# EAGLE design final (EAGLE 7.5.0)
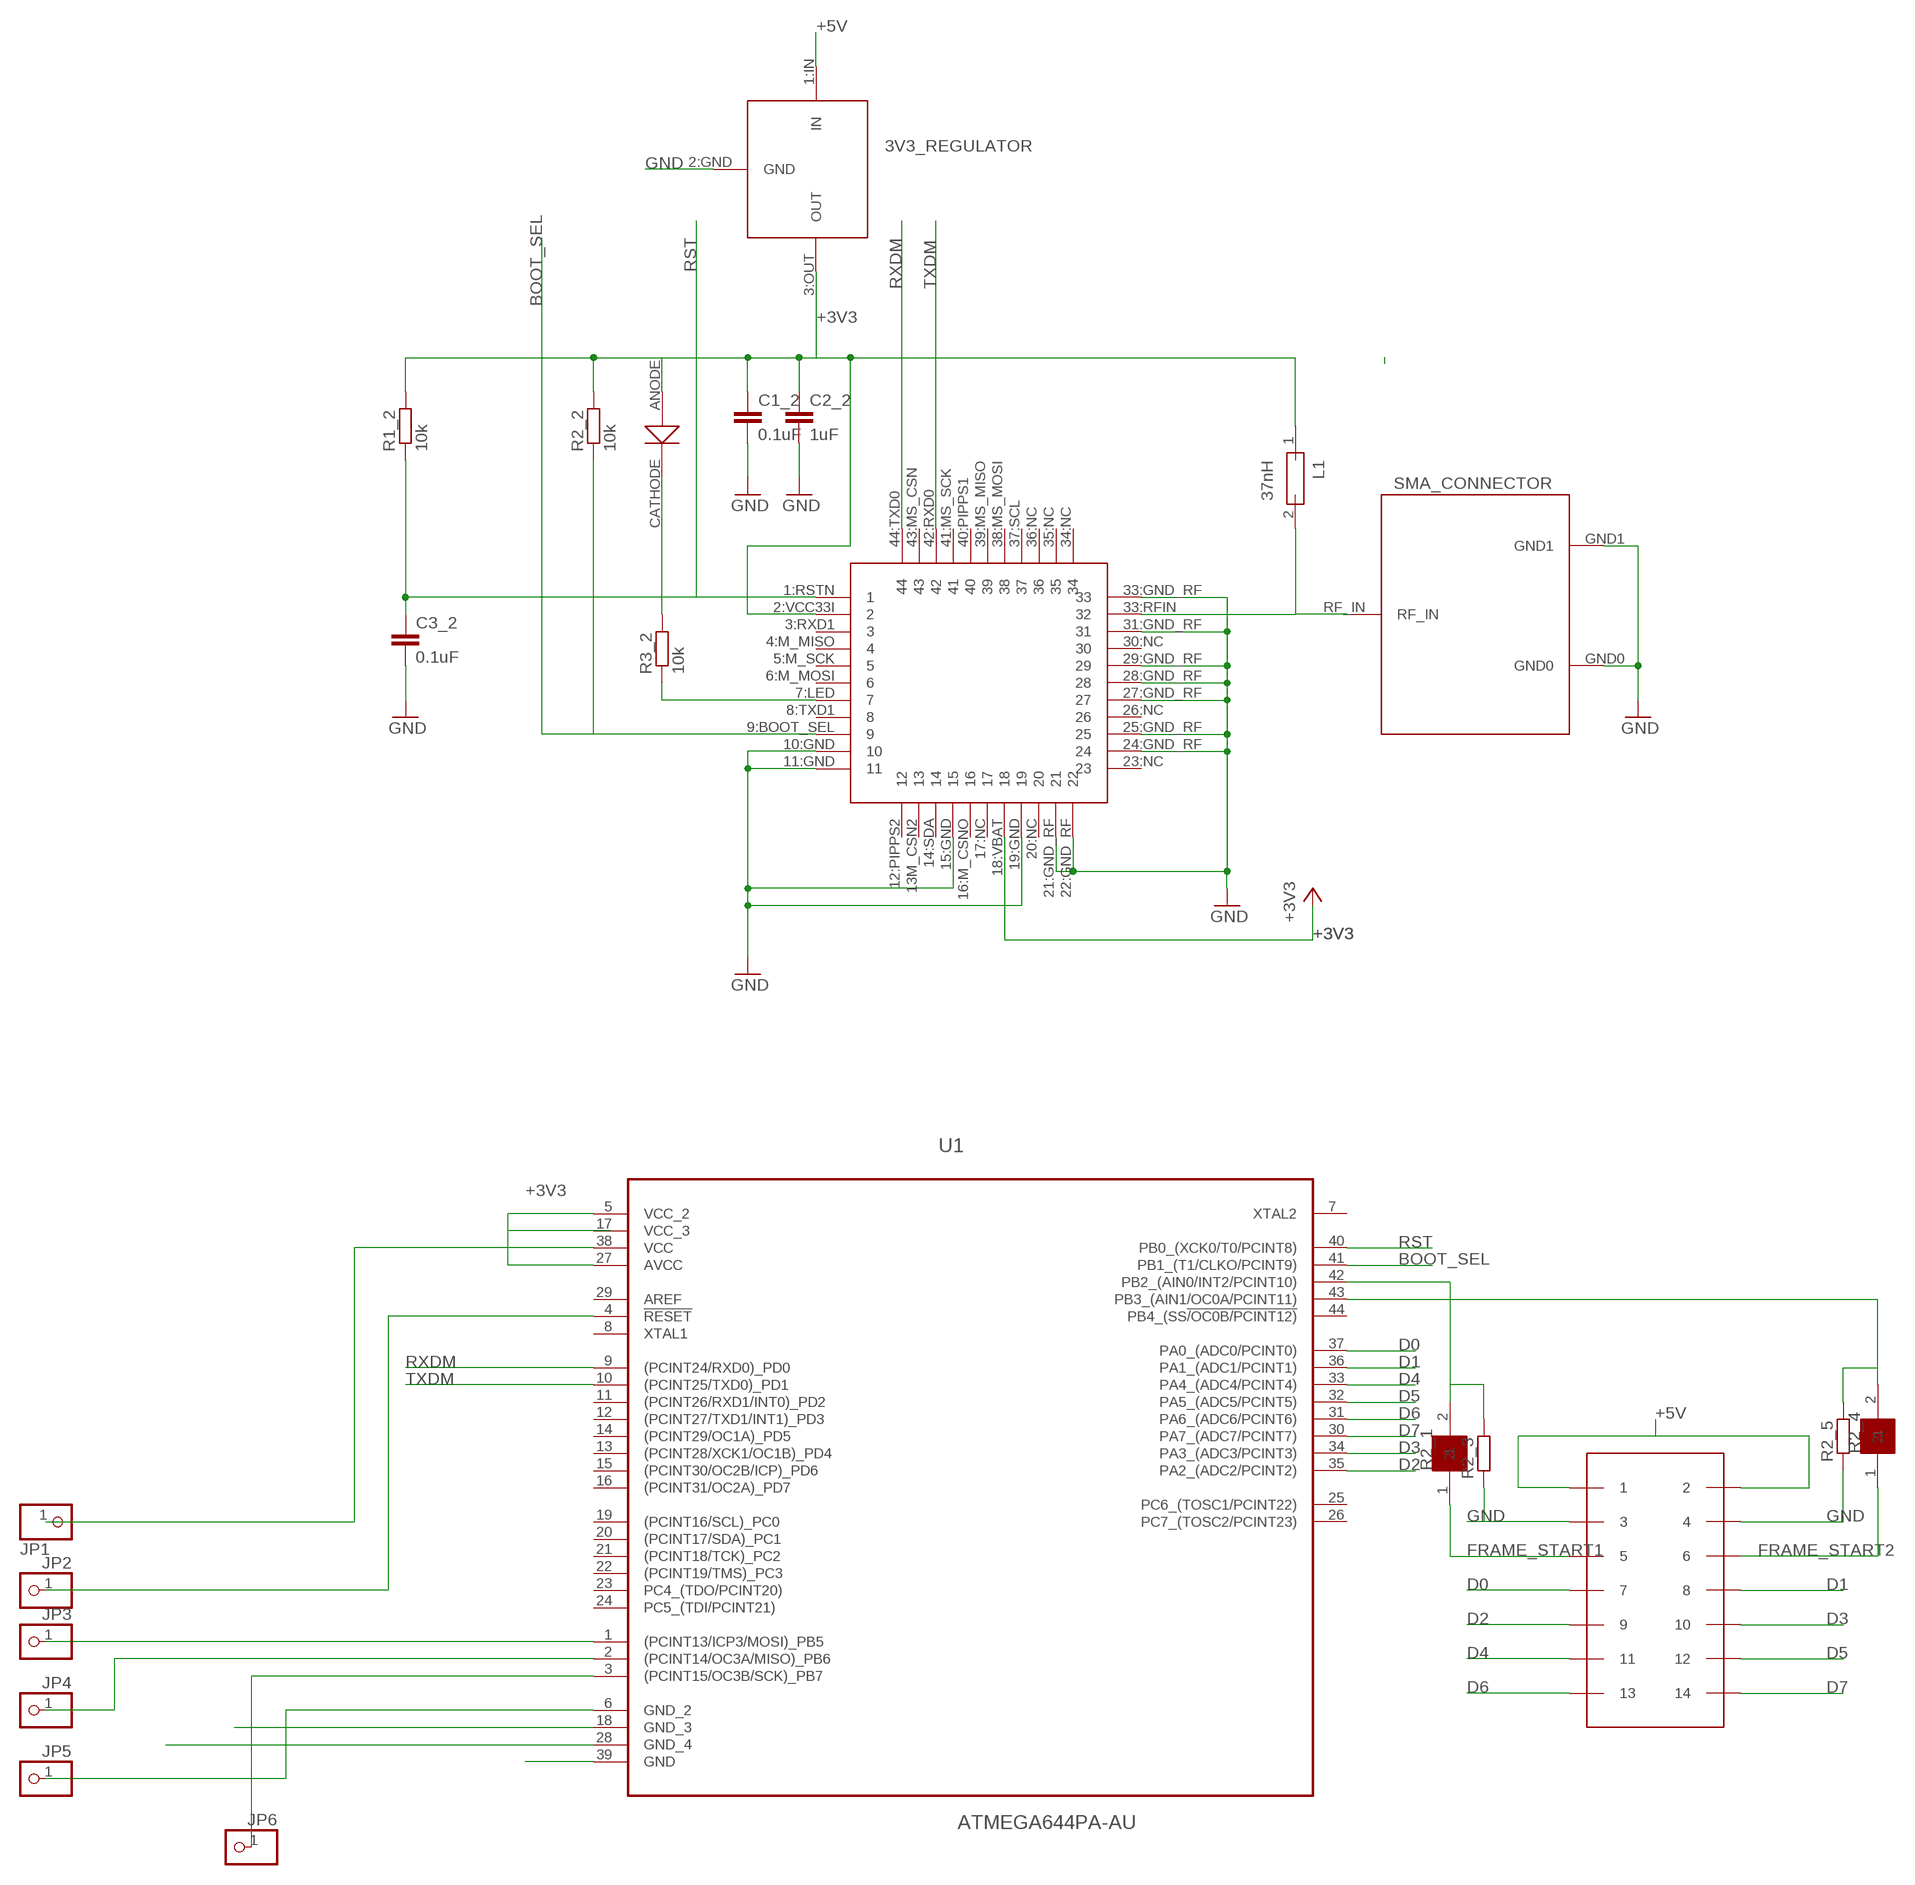
[diagram p0: schematic, sheet 1]

## Parts
3V3_REGULATOR  LM3940IT-3.3/NOPB  [3PIN]
C1_2  0.1uF  C-EUC0402  [C0402]
C2_2  1uF  C-EUC0402  [C0402]
C3_2  0.1uF  C-EUC0402  [C0402]
GPS_1  VENUS838FLPX  [LGA-44]
HARWIN_CONNECTOR  HARWIN_CONNECTOR  [14DIP]
JP1  PINHD-1X1  [1X01]
JP2  PINHD-1X1  [1X01]
JP3  PINHD-1X1  [1X01]
JP4  PINHD-1X1  [1X01]
JP5  PINHD-1X1  [1X01]
JP6  PINHD-1X1  [1X01]
L1  37nH  0805_INDUCTOR  [0805]
R1_2  10k  R-EU_R0402  [R0402]
R2_1  0805RESISTOR  [0805]
R2_2  10k  R-EU_R0402  [R0402]
R2_3  R-EU_R0402  [R0402]
R2_4  0805RESISTOR  [0805]
R2_5  R-EU_R0402  [R0402]
R3_2  10k  R-EU_R0402  [R0402]
SMA_CONNECTOR  SMA_SIDE  [SMA_SIDE]
U1  ATMEGA644PA-AU  [QFP80P1200X1200X120-44N]
U$1  HSMH-C190-DIODE  [HSMH-C190-DIODE]

## Nets
+3V3: 3V3_REGULATOR.3:OUT(OUT) C1_2.1 C2_2.1 GPS_1.2:VCC33I GPS_1.18:VBAT JP1.1 L1.1 R1_2.2 R2_2.2 U1.5(VCC_2) U1.17(VCC_3) U1.27(AVCC) U1.38(VCC) U$1.ANODE(AN)
+5V: 3V3_REGULATOR.1:IN(IN) HARWIN_CONNECTOR.1 HARWIN_CONNECTOR.2
BOOT_SEL: GPS_1.9:BOOT_SEL R2_2.1 U1.41(PB1_(T1/CLKO/PCINT9))
D0: HARWIN_CONNECTOR.7 U1.37(PA0_(ADC0/PCINT0))
D1: HARWIN_CONNECTOR.8 U1.36(PA1_(ADC1/PCINT1))
D2: HARWIN_CONNECTOR.9 U1.35(PA2_(ADC2/PCINT2))
D3: HARWIN_CONNECTOR.10 U1.34(PA3_(ADC3/PCINT3))
D4: HARWIN_CONNECTOR.11 U1.33(PA4_(ADC4/PCINT4))
D5: HARWIN_CONNECTOR.12 U1.32(PA5_(ADC5/PCINT5))
D6: HARWIN_CONNECTOR.13 U1.31(PA6_(ADC6/PCINT6))
D7: HARWIN_CONNECTOR.14 U1.30(PA7_(ADC7/PCINT7))
FRAME_START1: HARWIN_CONNECTOR.5 R2_1.1
FRAME_START2: HARWIN_CONNECTOR.6 R2_4.1
GND: 3V3_REGULATOR.2:GND(GND) C1_2.2 C2_2.2 C3_2.2 GPS_1.10:GND GPS_1.11:GND GPS_1.15:GND GPS_1.19:GND GPS_1.21:GND_RF GPS_1.22:GND_RF GPS_1.24:GND_RF GPS_1.25:GND_RF GPS_1.27:GND_RF GPS_1.28:GND_RF GPS_1.29:GND_RF GPS_1.31:GND_RF GPS_1.33:GND_RF HARWIN_CONNECTOR.3 HARWIN_CONNECTOR.4 JP5.1 R2_3.1 R2_5.1 SMA_CONNECTOR.GND0 SMA_CONNECTOR.GND1 U1.6(GND_2) U1.18(GND_3) U1.28(GND_4) U1.39(GND)
MISO: JP4.1 U1.2((PCINT14/OC3A/MISO)_PB6)
MOSI: JP3.1 U1.1((PCINT13/ICP3/MOSI)_PB5)
N$2: R3_2.2 U$1.CATHODE(CATH)
N$3: GPS_1.7:LED R3_2.1
N$5: R2_1.2 R2_3.2 U1.42(PB2_(AIN0/INT2/PCINT10))
N$6: R2_4.2 R2_5.2 U1.43(PB3_(AIN1/OC0A/PCINT11))
RESET: JP2.1 U1.4(!RESET)
RFIN_2: GPS_1.33:RFIN L1.2 SMA_CONNECTOR.RF_IN
RST: C3_2.1 GPS_1.1:RSTN R1_2.1 U1.40(PB0_(XCK0/T0/PCINT8))
RXDM: GPS_1.44:TXD0 U1.9((PCINT24/RXD0)_PD0)
SCK: JP6.1 U1.3((PCINT15/OC3B/SCK)_PB7)
TXDM: GPS_1.42:RXD0 U1.10((PCINT25/TXD0)_PD1)
Unconnected: GPS_1.3:RXD1 GPS_1.4:M_MISO GPS_1.5:M_SCK GPS_1.6:M_MOSI GPS_1.8:TXD1 GPS_1.12:PIPPS2 GPS_1.13M_CSN2 GPS_1.14:SDA GPS_1.16:M_CSNO GPS_1.17:NC GPS_1.20:NC GPS_1.23:NC GPS_1.26:NC GPS_1.30:NC GPS_1.34:NC GPS_1.35:NC GPS_1.36:NC GPS_1.37:SCL GPS_1.38:MS_MOSI GPS_1.39:MS_MISO GPS_1.40:PIPPS1 GPS_1.41:MS_SCK GPS_1.43:MS_CSN U1.7(XTAL2) U1.8(XTAL1) U1.11((PCINT26/RXD1/INT0)_PD2) U1.12((PCINT27/TXD1/INT1)_PD3) U1.13((PCINT28/XCK1/OC1B)_PD4) U1.14((PCINT29/OC1A)_PD5) U1.15((PCINT30/OC2B/ICP)_PD6) U1.16((PCINT31/OC2A)_PD7) U1.19((PCINT16/SCL)_PC0) U1.20((PCINT17/SDA)_PC1) U1.21((PCINT18/TCK)_PC2) U1.22((PCINT19/TMS)_PC3) U1.23(PC4_(TDO/PCINT20)) U1.24(PC5_(TDI/PCINT21)) U1.25(PC6_(TOSC1/PCINT22)) U1.26(PC7_(TOSC2/PCINT23)) U1.29(AREF) U1.44(PB4_(SS!/OC0B/PCINT12))

## Library data of the parts
3V3_REGULATOR = voltage_regulator:LM3940IT-3.3/NOPB
C1_2 C2_2 C3_2 = resistor:C-EU: CAPACITOR, European symbol
GPS_1 = Venus838flpX (1):VENUS838FLPX
HARWIN_CONNECTOR = connector:HARWIN_CONNECTOR
JP1-JP6 = pinhead:PINHD-1X1: PIN HEADER
L1 = inductor:0805_INDUCTOR
R1_2 R2_2 R2_3 R2_5 R3_2 = resistor:R-EU_: RESISTOR, European symbol
R2_1 R2_4 = 0805:0805RESISTOR
SMA_CONNECTOR = SMA:SMA_SIDE
U1 = ATMEGA644paau:ATMEGA644PA-AU: 8-bit Microcontroller with 16/32/64/128K Bytes,TQFP-44; MPN: ATMEGA644PA-AU; OC_FARNELL: 1972106; OC_NEWARK: 68T3119; PACKAGE: TQFP-44; SUPPLIER: ATMEL
U$1 = 0201_diode:HSMH-C190-DIODE

## Board
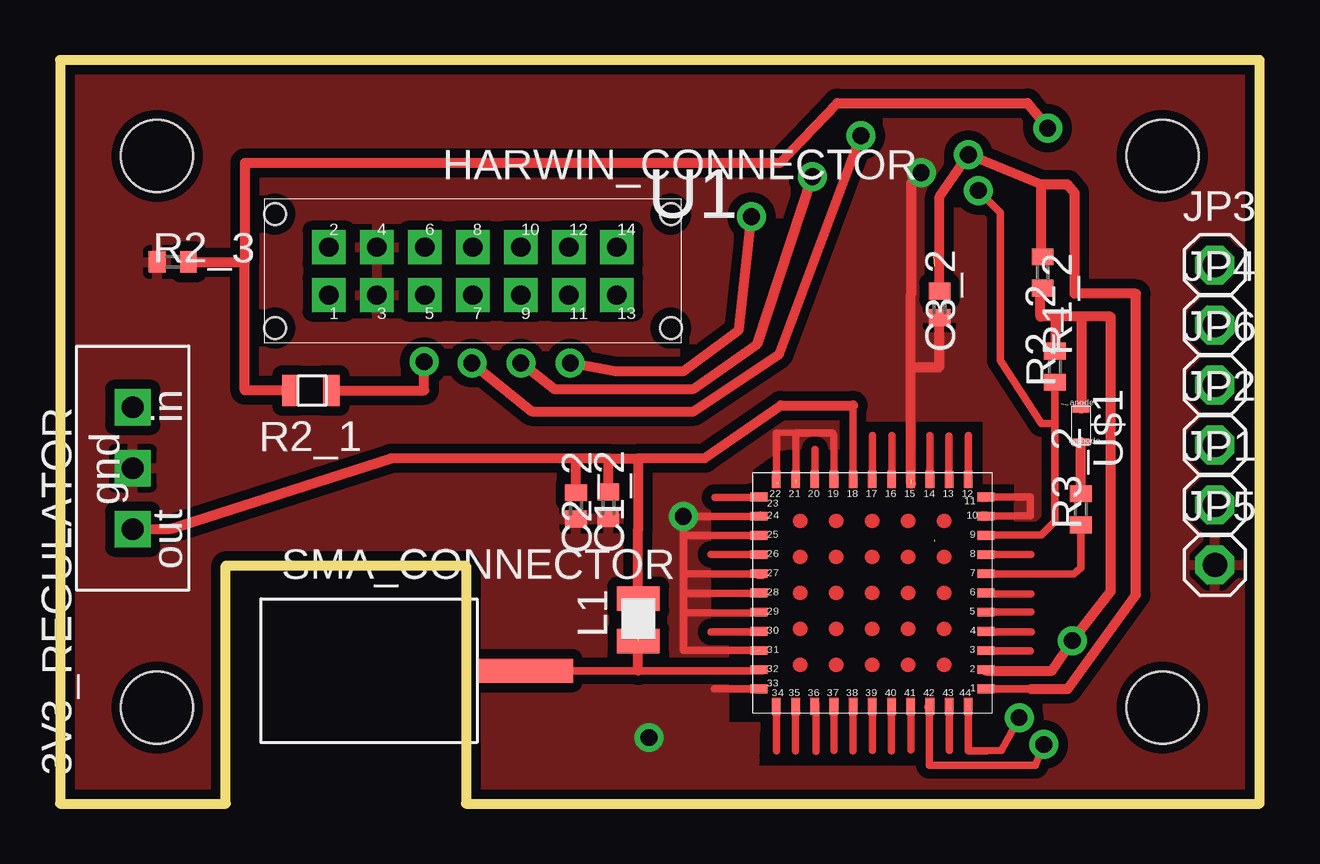
[diagram p1: board, top side]
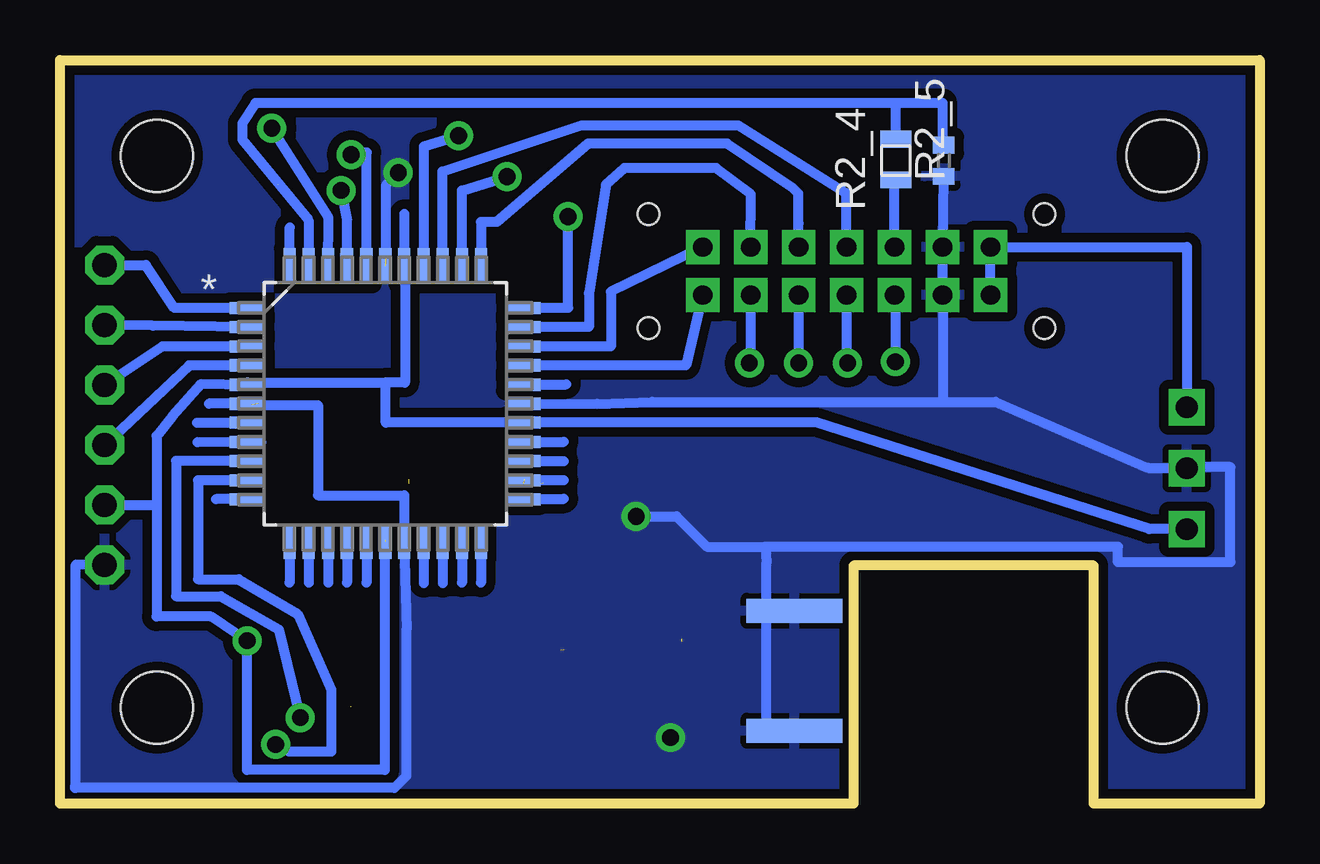
[diagram p2: board, bottom side, seen from below]

Size 50 x 31 mm. Coordinates in mm from the lower left corner, seen from the top.
Outline: 0,0 6.91,0 6.91,9.92 16.92,9.92 16.92,0 50,0 50,31 0,31 0,0
Copper layers (1*16): Top 0.035mm / dielectric 1.5mm / Bottom 0.035mm
Design rules "SparkFun *": minimum track width 8mil, minimum drill 20mil, track to track 0.3mm, track to pad 8mil, pad to pad 8mil, via to via 8mil, smd to smd 8mil, copper to edge 8mil, drill to drill 8mil, minimum pad ring 12mil, minimum via ring 10mil, stop-mask expansion 4mil, vias tented up to drill 20mil, thermal gap 10mil
Holes 3 mm at 4.05,4 45.95,4 45.95,27 4.05,27

### Footprints (pad centres in the part's own frame; a part is rotated, then mirrored left to right if it is on the bottom)
3PIN = drill 0.9 square: 1:IN -2.54,0; 2:GND 0,0; 3:OUT 2.54,0
C0402 = smd 0.7 x 0.9: 1 -0.65,0; 2 0.45,0
LGA-44 = smd 0.7 x 0.36: 1:RSTN -4.73,4; 2:VCC33I -4.73,3.2; 3:RXD1 -4.73,2.4; 4:M_MISO -4.73,1.6; 5:M_SCK -4.73,0.8; 6:M_MOSI -4.73,0; 7:LED -4.73,-0.8; 8:TXD1 -4.73,-1.6; 9:BOOT_SEL -4.73,-2.4; 10:GND -4.73,-3.2; 11:GND -4.73,-4; 23:NC 4.73,-4; 24:GND_RF 4.73,-3.2; 25:GND_RF 4.73,-2.4; 26:NC 4.73,-1.6; 27:GND_RF 4.73,-0.8; 28:GND_RF 4.73,0; 29:GND_RF 4.73,0.8; 30:NC 4.73,1.6; 31:GND_RF 4.73,2.4; 33:GND_RF 4.73,4; 33:RFIN 4.73,3.2 | smd 0.36 x 0.7: 12:PIPPS2 -4,-4.73; 13M_CSN2 -3.2,-4.73; 14:SDA -2.4,-4.73; 15:GND -1.6,-4.73; 16:M_CSNO -0.8,-4.73; 17:NC 0,-4.73; 18:VBAT 0.8,-4.73; 19:GND 1.6,-4.73; 20:NC 2.4,-4.73; 21:GND_RF 3.2,-4.73; 22:GND_RF 4,-4.73; 34:NC 4,4.73; 35:NC 3.2,4.73; 36:NC 2.4,4.73; 37:SCL 1.6,4.73; 38:MS_MOSI 0.8,4.73; 39:MS_MISO 0,4.73; 40:PIPPS1 -0.8,4.73; 41:MS_SCK -1.6,4.73; 42:RXD0 -2.4,4.73; 43:MS_CSN -3.2,4.73; 44:TXD0 -4,4.73
14DIP = drill 0.8 square: 1 -6,-1; 2 -6,1; 3 -4,-1; 4 -4,1; 5 -2,-1; 6 -2,1; 7 0,-1; 8 0,1; 9 2,-1; 10 2,1; 11 4,-1; 12 4,1; 13 6,1; 14 6,-1 | hole 0.9: -8.25,2.375; -8.25,-2.375; 8.25,2.375; 8.25,-2.375
1X01 = drill 1.016 octagon: 1 0,0
0805 = smd 1.02 x 1.78: 1 -0.89,0; 2 0.89,0
R0402 = smd 0.7 x 0.9: 1 -0.65,0; 2 0.65,0
0805' = smd 1.3 x 0.7: 1 0,0; 2 0,1.7
SMA_SIDE = smd 4 x 1 bottom: GND0 0,2.5; GND1 0,-2.5 | smd 4 x 1: RF_IN 0,0
QFP80P1200X1200X120-44N = smd 1.473 x 0.508: 1 -5.74,3.988; 2 -5.74,3.2; 3 -5.74,2.388; 4 -5.74,1.6; 5 -5.74,0.787; 6 -5.74,0; 7 -5.74,-0.787; 8 -5.74,-1.6; 9 -5.74,-2.388; 10 -5.74,-3.2; 11 -5.74,-3.988; 23 5.74,-3.988; 24 5.74,-3.2; 25 5.74,-2.388; 26 5.74,-1.6; 27 5.74,-0.787; 28 5.74,0; 29 5.74,0.787; 30 5.74,1.6; 31 5.74,2.388; 32 5.74,3.2; 33 5.74,3.988 | smd 0.508 x 1.473: 12 -3.988,-5.74; 13 -3.2,-5.74; 14 -2.388,-5.74; 15 -1.6,-5.74; 16 -0.787,-5.74; 17 0,-5.74; 18 0.787,-5.74; 19 1.6,-5.74; 20 2.388,-5.74; 21 3.2,-5.74; 22 3.988,-5.74; 34 3.988,5.74; 35 3.2,5.74; 36 2.388,5.74; 37 1.6,5.74; 38 0.787,5.74; 39 0,5.74; 40 -0.787,5.74; 41 -1.6,5.74; 42 -2.388,5.74; 43 -3.2,5.74; 44 -3.988,5.74
HSMH-C190-DIODE = smd 0.3 x 0.7: ANODE -0.7,0; CATHODE 0.7,0

### Placement (x,y rotation side)
3V3_REGULATOR  3.03,13.98 270 top
C1_2  22.86,12.34 270 top
C2_2  21.51,12.31 270 top
C3_2  36.66,20.71 270 top
GPS_1  33.86,8.78 180 top
HARWIN_CONNECTOR  17.21,22.2 0 top
JP1  48.14,12.45 0 top
JP2  48.14,14.95 0 top
JP3  48.14,22.45 0 top
JP4  48.14,19.95 0 top
JP5  48.14,9.95 0 top
JP6  48.14,17.45 0 top
L1  24.1,7.66 270 top
R1_2  40.96,22.14 270 top
R2_1  0805RESISTOR  [0805']  11.31,17.22 90 top
R2_2  41.47,18.21 90 top
R2_3  4.7,22.58 0 top
R2_4  0805RESISTOR  [0805']  15.16,26 0 bottom
R2_5  13.16,26.8 90 bottom
R3_2  42.55,12.27 90 top
SMA_CONNECTOR  19.38,5.54 0 top
U1  36.44,16.67 0 bottom
U$1  42.56,15.76 270 top

### Tracks (layer width: path | path; a pad name or v marks a point on that pad's centre or on a via)
+3V3  (via drill 0.7)  (1 unrouted)
  Top 0.305: 33.06,16.6 GPS_1.18:VBAT | GPS_1.2:VCC33I 38.59,5.54
  Top 0.406: 3V3_REGULATOR.3:OUT 4.6,11.45 13.79,14.39 21.45,14.39 | 22.87,14.39 21.45,14.39 | 24.1,14.4 24.1,11.43 L1.1 | 24.1,14.4 26.88,14.4 30.05,16.6 33.06,16.6 | R1_2.2 arc90 40.87,21.4 40.87,20.3 41.5,20.3 | 42.6,20.3 43.8,20.3 43.8,8.84 v42.2,6.79 41.35,5.54 38.59,5.54 | 42.6,20.3 41.5,20.3 | U$1.ANODE 42.6,16.5 42.6,20.3 | R2_2.2 41.5,18.89 41.5,20.3 | 22.87,14.39 24.09,14.39 24.1,14.4 | 21.45,14.39 21.51,14.32 C2_2.1 | C1_2.1 22.86,14.38 22.87,14.39
  Bottom 0.406: U1.17 36.42,10.93 | 36.42,17.55 36.42,15.88 U1.27 28.1,15.89 27.41,15.89 18.47,15.89 4.6,11.44 3V3_REGULATOR.3:OUT | U1.38 35.62,22.41 35.62,17.55 36.42,17.55 | 36.42,17.55 36.42,17.56 42.18,17.56 U1.5 44.12,17.49 45.33,16.13 45.97,15.33 45.97,12.45 | 45.97,12.45 45.97,7.79 43.7,7.79 v42.2,6.79 42.2,1.4 36.45,1.4 36.45,11 36.44,11 | JP1.1 45.97,12.45
+5V
  Bottom 0.406: HARWIN_CONNECTOR.1 HARWIN_CONNECTOR.2 3.03,23.2 3V3_REGULATOR.1:IN
BOOT_SEL  (via drill 0.7)
  Top 0.203: 38.49,11.19 GPS_1.9:BOOT_SEL
  Top 0.305: 38.47,11.19 38.49,11.19 40.9,11.2 41.47,11.77 41.47,15.85 | v38.28,25.56 39.2,24.64 39.2,18.46 40.9,15.85 41.47,15.85 | 41.47,15.85 R2_2.1
  Bottom 0.406: v38.28,25.56 38.04,24.29 38.04,23.03 38.11,22.93 38.11,22.37 38.07,22.41 U1.41
D0  (via drill 0.7)
  Top 0.406: v17.17,18.37 19.67,16.35 26.41,16.35 29.98,18.74 v33.39,27.84
  Bottom 0.406: U1.37 34.83,22.45 34.83,27.4 v33.39,27.84 | HARWIN_CONNECTOR.7 17.21,18.41 v17.17,18.37
D1
  Bottom 0.406: U1.36 34.05,26.35 28.24,28.28 21.73,28.28 17.23,25.45 17.23,23.2 HARWIN_CONNECTOR.8
D2  (via drill 0.7)
  Top 0.406: v31.37,26.13 29.07,19.16 26.4,17.29 20.59,17.29 v19.21,18.37
  Bottom 0.406: U1.35 33.24,25.56 v31.37,26.13 | HARWIN_CONNECTOR.9 v19.21,18.37
D3
  Bottom 0.305: 31.8,24.25 31.8,24.24
  Bottom 0.406: HARWIN_CONNECTOR.10 19.21,24.18 19.22,24.18 19.22,25.43 19.44,25.65 22.19,27.52 27.98,27.52 31.8,24.25 | U1.34 32.45,24.24 31.8,24.24
D4  (via drill 0.7)
  Top 0.406: v28.82,24.47 28.3,19.75 25.96,18.02 23.16,18.02 v21.27,18.37
  Bottom 0.406: U1.33 28.82,20.66 v28.82,24.47 | HARWIN_CONNECTOR.11 21.21,18.37 v21.27,18.37
D5
  Bottom 0.406: U1.32 27.95,19.87 27.95,21.28 27.24,25.8 26.47,26.5 22.65,26.5 21.2,25.4 HARWIN_CONNECTOR.12
D6
  Bottom 0.406: HARWIN_CONNECTOR.13 27.03,21.34 27.03,19.06 U1.31
D7
  Bottom 0.406: HARWIN_CONNECTOR.14 23.91,18.27 U1.30
FRAME_START1  (via drill 0.7)
  Top 0.406: R2_1.1 15.18,17.22 v15.18,18.42
  Bottom 0.406: HARWIN_CONNECTOR.5 15.17,21.2 15.17,19.1 v15.18,18.42
FRAME_START2
  Bottom 0.406: HARWIN_CONNECTOR.6 15.21,25.95 R2_4.1
GND  (via drill 0.7)  (6 unrouted)
  Top 0.203: GPS_1.27:GND_RF 29.19,9.56 GPS_1.27:GND_RF | GPS_1.29:GND_RF 29.19,8.05 29.13,7.95 | GPS_1.28:GND_RF 29.19,8.81 29.13,8.76 | 29.19,4.78 GPS_1.33:GND_RF | 29.19,4.78 | 29.19,11.17 GPS_1.25:GND_RF | GPS_1.24:GND_RF 29.19,12.08 29.19,11.97 | GPS_1.10:GND 38.49,12.08 38.49,11.98 | GPS_1.11:GND 38.49,12.83 38.49,12.78 | 35.48,13.59 GPS_1.15:GND | GPS_1.19:GND 32.2,13.59 32.25,13.59 | 32.2,15.45 32.25,15.35 | 29.94,13.34 GPS_1.22:GND_RF | 27.17,9.56 25.98,9.57 | 29.31,6.31 29,6.4
  Top 0.254: 30.67,15.45 29.86,15.45
  Top 0.305: GPS_1.10:GND 40.45,11.98 40.45,12.78 GPS_1.11:GND | 32.25,13.35 32.25,13.59 32.25,15.35 | 29.28,11.97 29.19,11.97 v25.98,11.97 25.98,11.18 | 27.13,11.17 GPS_1.25:GND_RF 29.29,11.17 | 25.98,9.57 GPS_1.27:GND_RF | 25.98,8.76 29.13,8.76 29.28,8.76 | 25.98,7.95 29.13,7.95 | 27.28,4.78 GPS_1.33:GND_RF | GPS_1.33:GND_RF 29.19,4.78 29.28,4.78 | 29.24,4.78 GPS_1.33:GND_RF | 29.19,11.17 GPS_1.25:GND_RF | 35.48,13.34 35.47,13.34 | GPS_1.25:GND_RF 25.99,11.18 | GPS_1.25:GND_RF 25.98,11.18 | GPS_1.31:GND_RF 25.98,6.38 25.98,7.95 | 30.67,15.4 30.67,13.35 | 25.98,8.76 25.98,9.57 | 25.98,9.57 25.98,11.18 | 25.98,7.95 25.98,8.76 | 32.2,15.45 30.67,15.45 30.67,15.4 | 30.67,15.4 30.7,15.4 | v35.9,26.3 35.47,25.87 | 29.86,13.36 29.86,15.45
  Top 0.406: 38.45,11.98 38.49,11.98 GPS_1.10:GND | 38.44,12.78 38.49,12.78 GPS_1.11:GND | GPS_1.27:GND_RF 29.27,9.57 | 35.47,25.87 35.47,21.25 35.48,18.19 | 35.48,18.19 36.65,18.19 36.65,19.35 C3_2.2 | 35.48,13.34 35.48,18.19
  Bottom 0.203: 42.02,16.61 U1.6
  Bottom 0.406: HARWIN_CONNECTOR.3 HARWIN_CONNECTOR.4 13.18,26.15 R2_5.1 | 13.2,16.74 10.99,16.75 4.65,14 3V3_REGULATOR.2:GND 3.28,14.03 1.21,14.03 1.21,10.06 5.9,10.06 5.9,10.7 20.6,10.7 | 20.6,10.7 20.55,10.06 20.55,8.04 | v25.98,11.97 24.3,11.97 23.03,10.7 20.6,10.7 | U1.28 27.61,16.66 25.32,16.74 13.2,16.74 | SMA_CONNECTOR.GND0 20.55,8.04 | SMA_CONNECTOR.GND1 20.55,3.04 20.55,8.04 | 13.19,21.2 HARWIN_CONNECTOR.3 | HARWIN_CONNECTOR.3 13.2,16.74 | JP5.1 49.34,9.96 49.35,0.65 | 49.35,0.65 49.37,0.65 49.37,0.72 | 41.73,16.67 43.8,16.67 | 36.4,22.8 36.4,25.8 v35.9,26.3 | 42.02,16.61 39.25,16.61 39.25,12.85 35.66,12.85 U1.18 35.55,7.25 35.55,1.15 36.05,0.65 49.35,0.65
  other vias: 24.55,2.75
  pour Bottom (isolate 0.4): -5.65,32.7 -12.6,-5.6 57.15,-5.2 56.05,36.35
  pour Top (isolate 0.4): -3.5,34.65 -9.7,-4.55 57.5,-7.2 57.5,41.15 17.3,42.35
MISO
  Bottom 0.406: U1.2 46.13,19.92 JP4.1
MOSI
  Bottom 0.406: U1.1 45.24,20.66 46.42,22.45 JP3.1
N$1
  Bottom 0.406: 35.64,22.3 35.64,24.59
N$2
  Top 0.406: R3_2.2 42.55,14.31 U$1.CATHODE
N$3
  Top 0.203: GPS_1.7:LED 38.49,9.56 38.49,9.58
  Top 0.305: 38.45,9.58 38.49,9.58 | R3_2.1 42.55,9.82 42.26,9.58 GPS_1.7:LED
N$5  (via drill 0.7)
  Top 0.406: v41.17,28.16 40.33,29.2 32.4,29.2 30,26.7 7.7,26.7 7.7,22.58 | R2_3.2 7.7,22.58 | R2_1.2 7.7,17.22 7.7,22.58
  Bottom 0.406: U1.42 38.81,24.42 v41.17,28.16
N$6
  Bottom 0.406: U1.43 39.64,24.32 42.4,27.68 42.4,28.35 41.85,29.2 15.3,29.2 | R2_5.2 13.2,27.45 13.2,29.2 15.3,29.2 | R2_4.2 15.16,29.06 15.3,29.2
N$7
  Top 0.305: 27.3,12.76 29.3,12.76
N$8
  Bottom 0.406: 40.43,21.98 40.42,24.03
N$9
  Bottom 0.406: 41.65,15.87 44.29,15.87
N$10
  Bottom 0.406: 41.6,15.06 44.28,15.07
N$11
  Top 0.305: 38.46,8.74 40.46,8.74
N$12
  Bottom 0.406: 41.63,12.69 43.49,12.69
N$13
  Bottom 0.406: 40.43,11.2 40.43,9.2
N$14
  Top 0.305: 27.13,10.38 29.13,10.38
N$15
  Bottom 0.406: 39.63,11.31 39.63,9.21
N$16
  Bottom 0.406: 38.82,11.21 38.82,9.21
N$17
  Top 0.305: 27.13,7.15 29.13,7.15
N$18
  Bottom 0.406: 38.04,11.11 38.04,9.21
N$19
  cutout Top: 29.6,14.4 28.9,13.9 28.9,12.25 27.15,12.25 27.15,9 27.15,9.05 27.15,7.7 27.9,7.7 27.9,3.4 29.2,3.4 29.15,1.6 39.6,1.6 39.75,13.3 38.45,13.3 38.45,15.9 35.7,15.9 35.7,14.75 35.25,14.75 35.25,15.9 33.6,15.9 33.6,14.75 30.3,14.75 30.05,14.7
N$20
  Bottom 0.406: 37.22,11 37.22,9.2
N$21
  cutout Top: 10,18.25 9.95,16.2 11.05,16.2 11,18.25
N$22
  Bottom 0.406: 34.84,11.09 34.84,9.19
N$23
  Bottom 0.406: 34.05,10.99 34.05,9.19
N$24
  Bottom 0.406: 33.24,11 33.24,9.2
N$25
  Top 0.305: 38.48,7.15 40.48,7.15
N$26
  Top 0.305: 38.45,6.36 40.45,6.36
N$27
  Top 0.305: 38.46,7.99 40.46,7.99
N$28
  Top 0.305: 38.46,10.38 40.46,10.38
N$29
  Top 0.305: 29.87,2.2 29.87,4.2
N$30
  Top 0.305: 31.5,2.18 31.5,4.18
N$31
  Top 0.305: 30.66,2.19 30.66,4.19
N$32
  Top 0.305: 33.05,2.2 33.05,4.2
N$33
  Top 0.305: 34.67,13.35 34.67,15.35
N$34
  Top 0.305: 33.87,2.21 33.87,4.21
N$35
  Top 0.305: 32.27,2.21 32.27,4.21
N$36
  Top 0.305: 34.66,2.2 34.66,4.2
N$37
  Top 0.305: 35.46,2.23 35.46,4.23
N$38
  Top 0.305: 37.07,2.22 37.07,4.22
N$39
  Bottom 0.406: 32.45,11.1 32.45,9.2
N$40
  Bottom 0.406: 30.9,12.7 29,12.7
N$41
  Top 0.305: 33.86,13.35 33.86,15.35
N$42
  Bottom 0.406: 30.91,13.48 29.01,13.48
N$43
  Top 0.305: 37.86,13.35 37.86,15.35
N$44
  Top 0.305: 37.06,13.33 37.06,15.33
N$45
  Top 0.305: 36.26,13.35 36.26,15.35
N$46
  Bottom 0.406: 31.01,14.28 29.01,14.28
N$47
  Top 0.305: 31.46,13.37 31.46,14.77
N$48
  Bottom 0.406: 30.9,15.08 29,15.08
N$49
  Bottom 0.406: 30.8,17.47 28.9,17.47
N$50
  cutout Bottom: 31.4,15.6 31.4,11.55 41.35,11.55 41.4,17.2 36.8,17.25 36.75,15.65 31.95,15.6 32.05,15.6
N$51
  cutout Bottom: 14.6,25.75 13.35,25.75 13.4,24.1 14.65,24.1 14.6,24.15
RESET
  Bottom 0.406: U1.4 44.62,18.27 JP2.1
RFIN_2  (1 unrouted)
  Top 0.203: GPS_1.33:RFIN 29.19,5.54 29.18,5.54
  Top 0.305: 29.27,5.54 29.18,5.54 24.1,5.54 SMA_CONNECTOR.RF_IN
  Top 0.406: 24.1,5.54 24.1,6.86
RST  (via drill 0.7)  (1 unrouted)
  Top 0.203: 38.49,4.78 GPS_1.1:RSTN | 38.49,4.78
  Top 0.305: 38.46,4.78 38.49,4.78 GPS_1.1:RSTN 40.47,4.78 | 37.87,27.1 v37.87,27.06
  Top 0.406: 40.9,25.8 v37.87,27.06 36.66,25.3 C3_2.1 | 40.47,4.78 42,4.78 44.85,8.7 44.85,21.26 42.3,21.26 42.3,25.45 42,25.81 40.91,25.81 40.91,22.84 R1_2.1
  Bottom 0.254: v37.87,27.06 38.17,27.15
  Bottom 0.406: U1.40 37.21,22.41 | 37.2,22.41 37.21,22.41 | 37.21,22.41 37.21,27.15 38.17,27.15
RXDM  (via drill 0.7)  (1 unrouted)
  Top 0.305: 37.86,4.03 37.86,2.2 38.64,2.2 39.24,2.22 v39.98,3.58
  Bottom 0.406: U1.9 45.16,14.28 45.16,8.64 43.3,8.64 40.88,7.26 v39.98,3.58
SCK
  Bottom 0.406: U1.3 45.73,19.06 JP6.1
TXDM  (via drill 0.7)
  Top 0.203: 36.23,4.03 GPS_1.42:RXD0
  Top 0.305: 36.24,4.02 36.24,1.59 40.55,1.59 40.65,1.6 v41.01,2.46
  Top 0.406: 36.23,4.03 36.24,4.02
  Bottom 0.406: U1.10 44.24,13.47 44.24,9.35 42.55,9.35 40.1,7.9 38.68,4.7 38.68,2.17 40.46,2.17 v41.01,2.46